# Altium schematic sheet 0109_AUDIO - CODEC MISC.SchDoc
size 848 x 558 mm
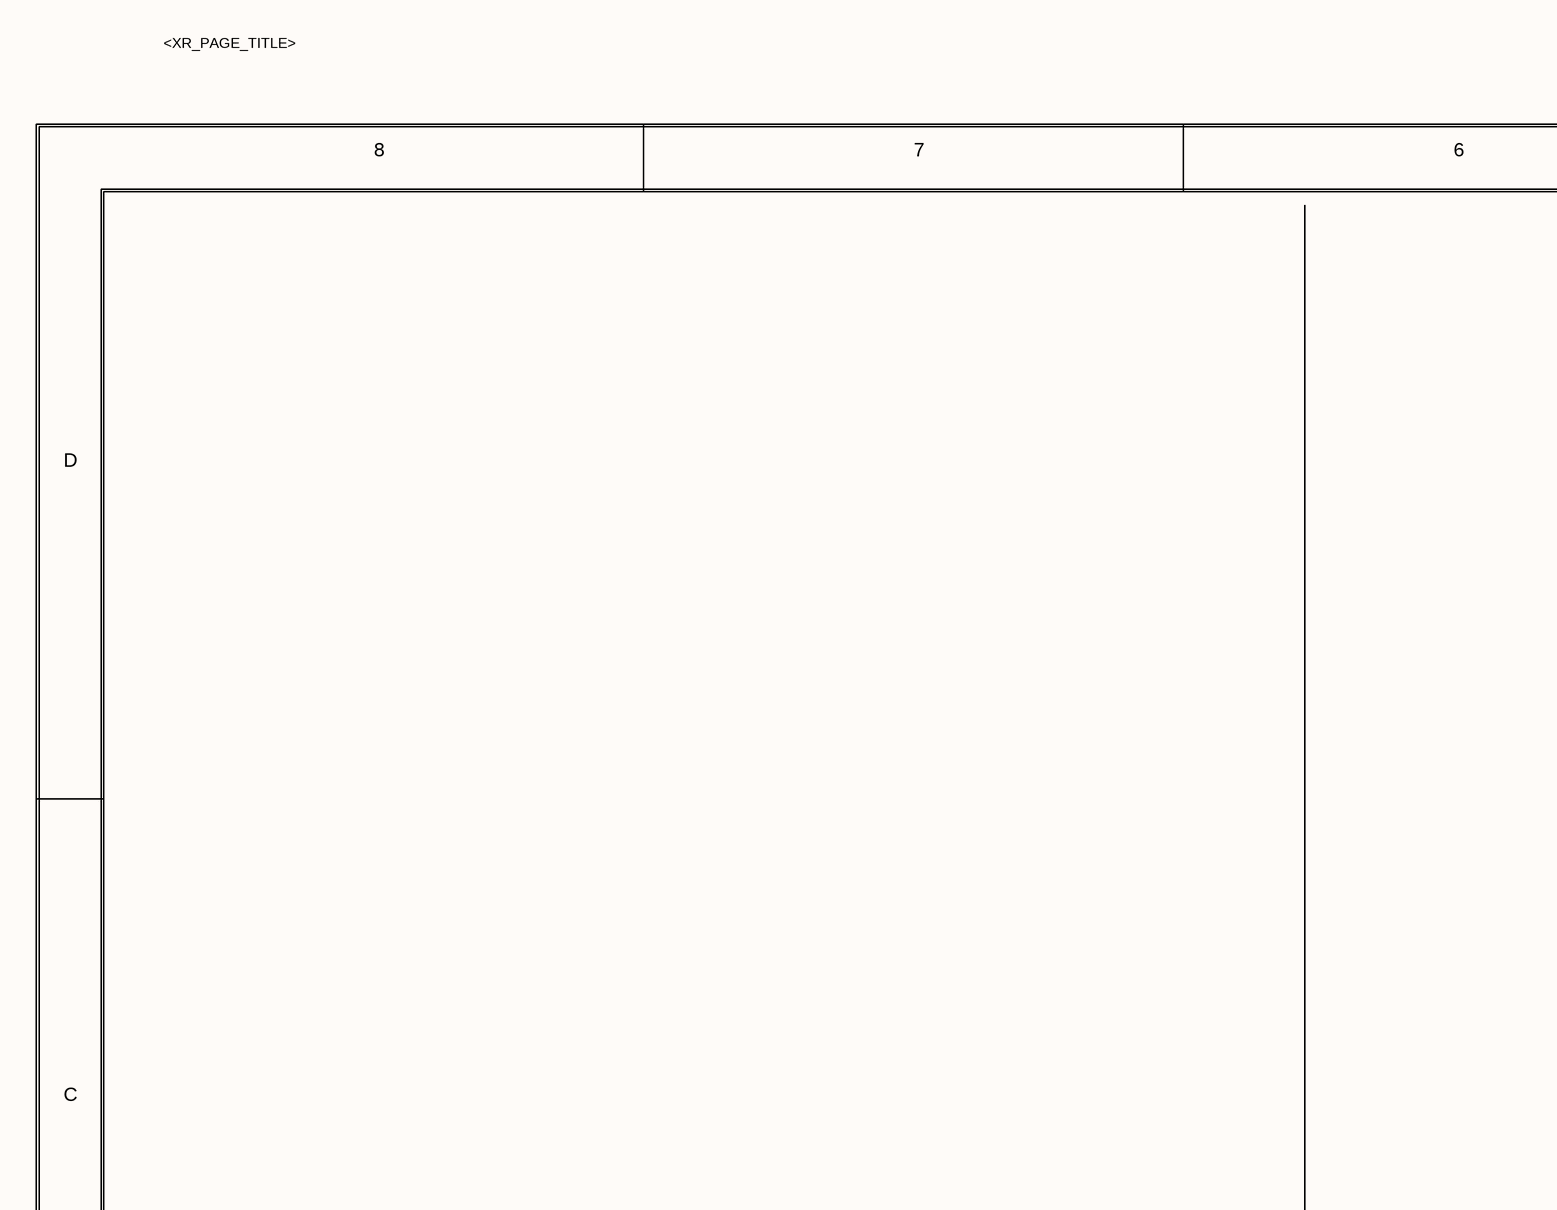
[diagram p0: 0109_AUDIO - CODEC MISC.SchDoc, top left]
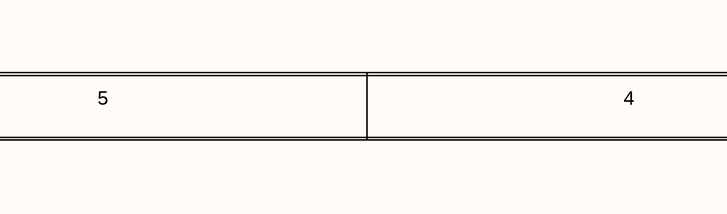
[diagram p1: 0109_AUDIO - CODEC MISC.SchDoc, top middle]
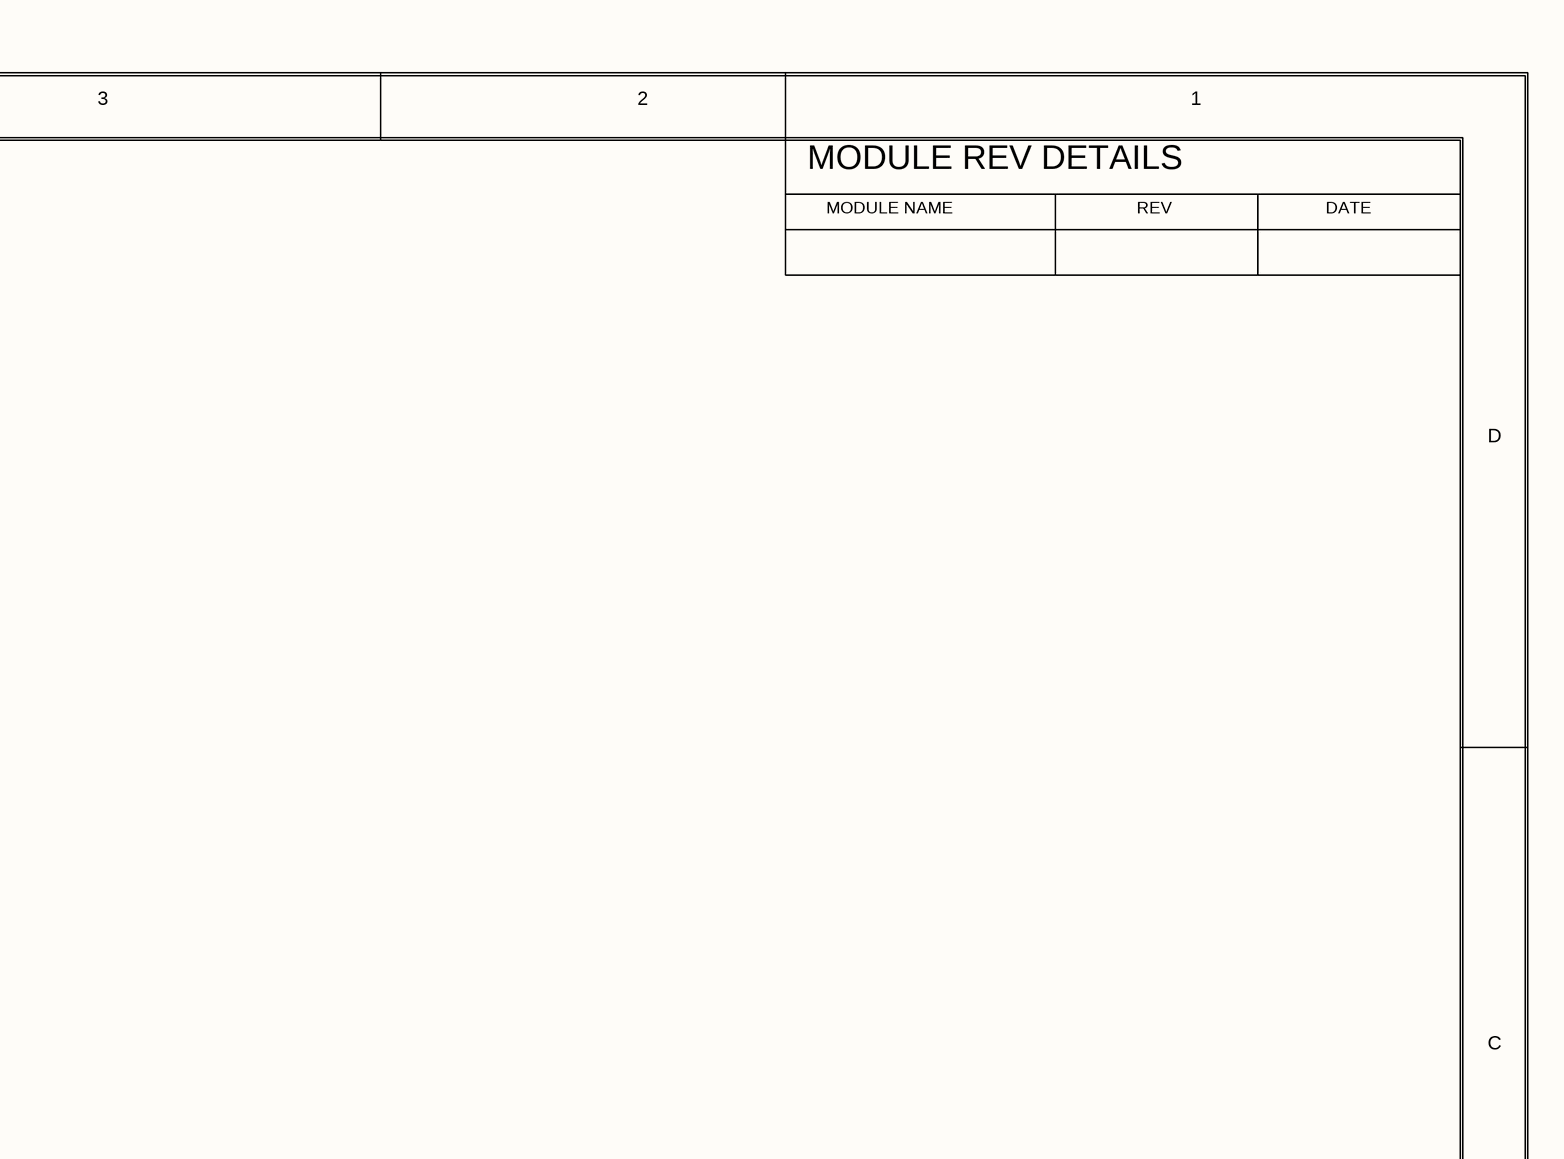
[diagram p2: 0109_AUDIO - CODEC MISC.SchDoc, top right]
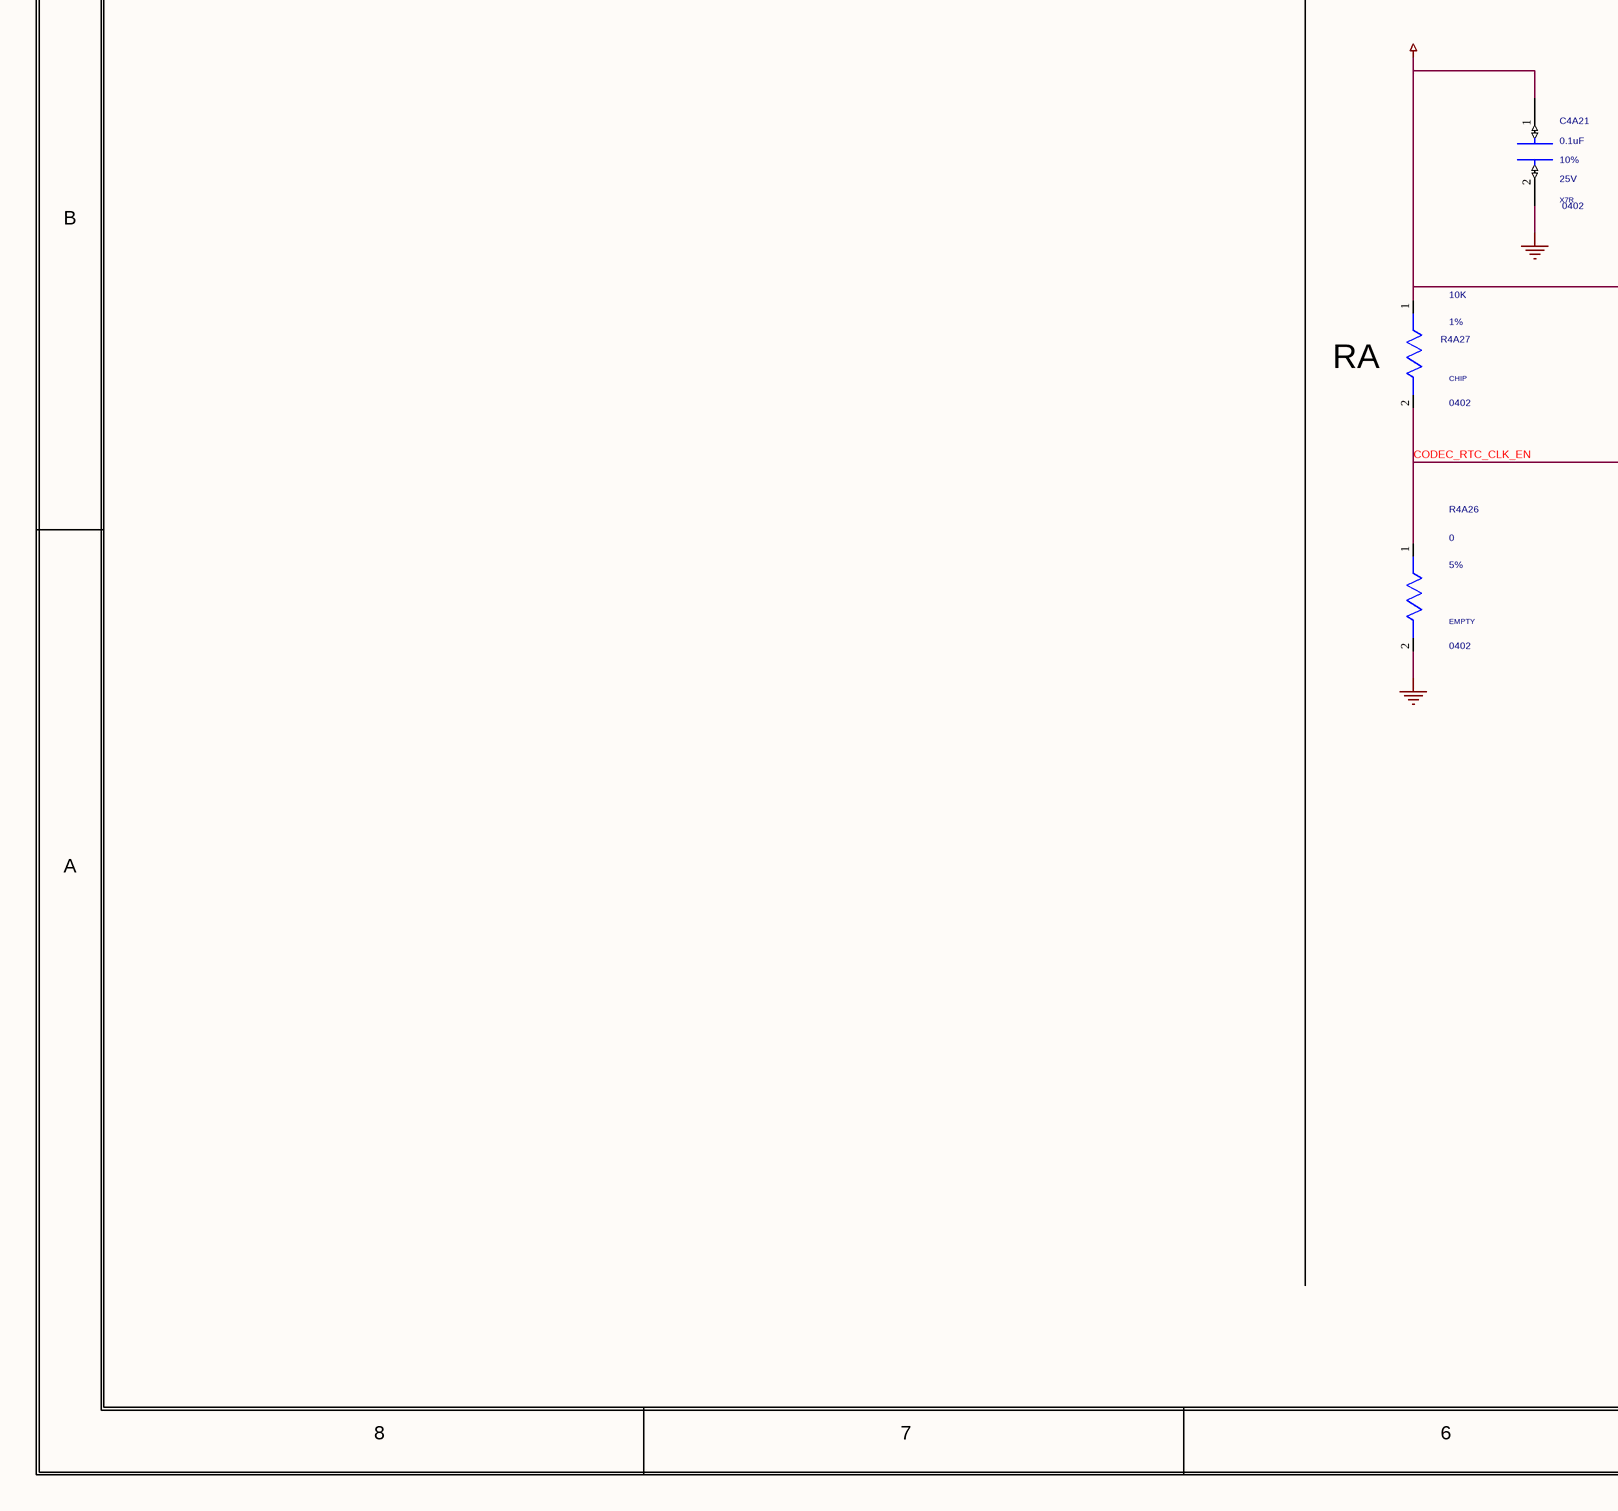
[diagram p3: 0109_AUDIO - CODEC MISC.SchDoc, bottom left]
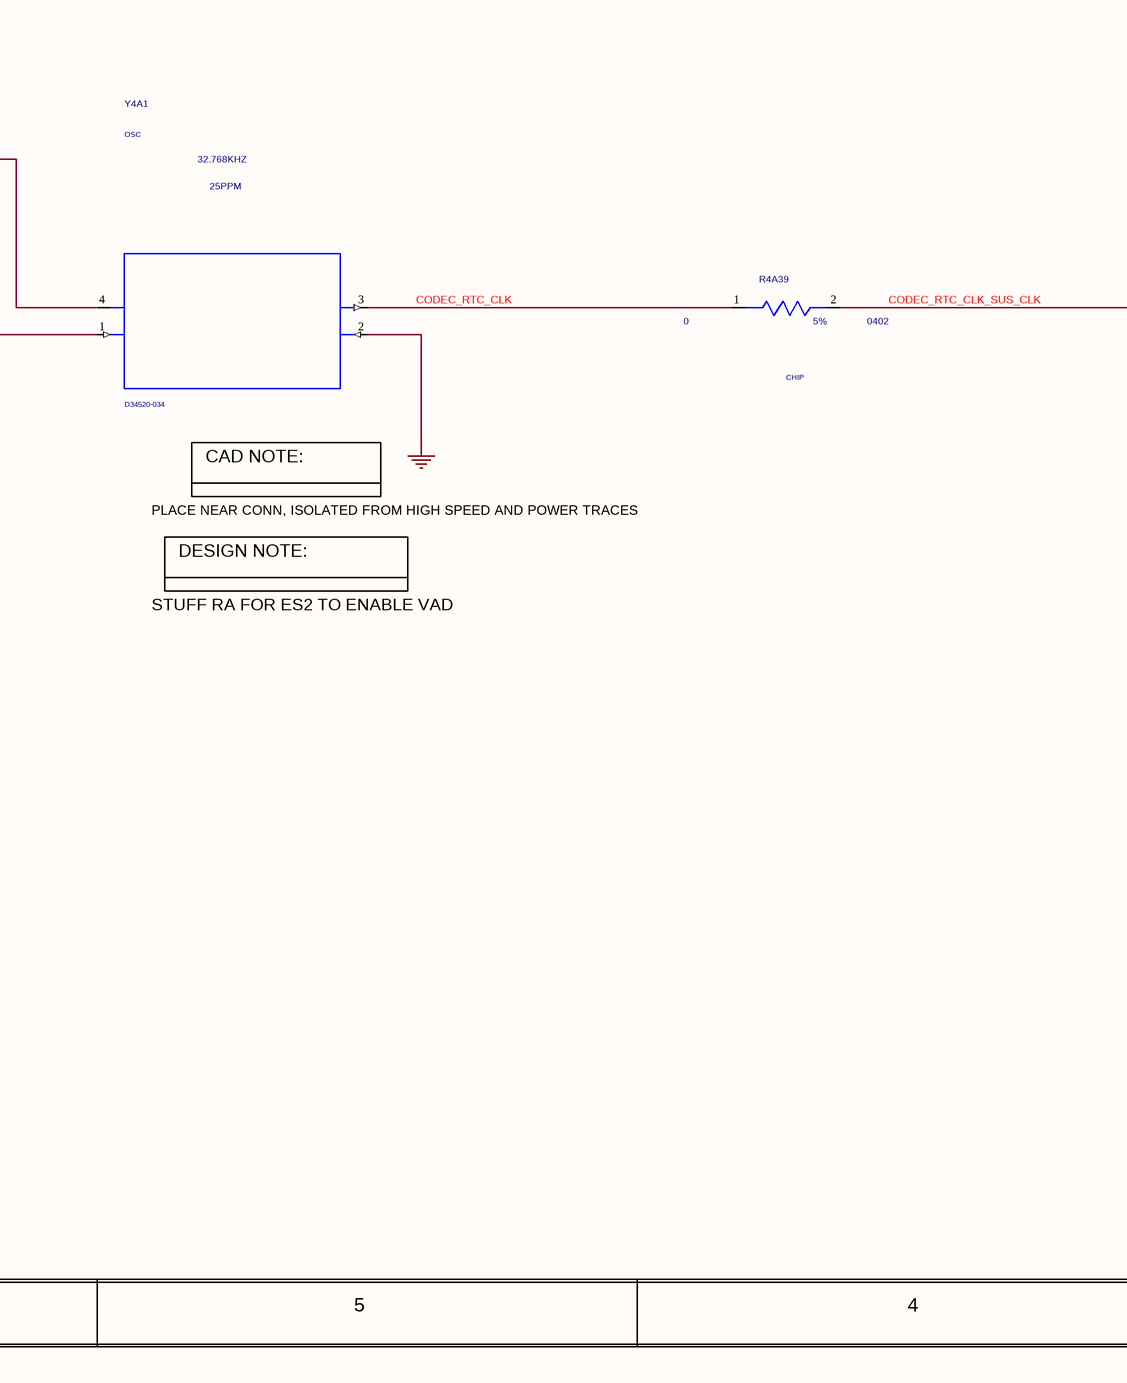
[diagram p4: 0109_AUDIO - CODEC MISC.SchDoc, bottom middle]
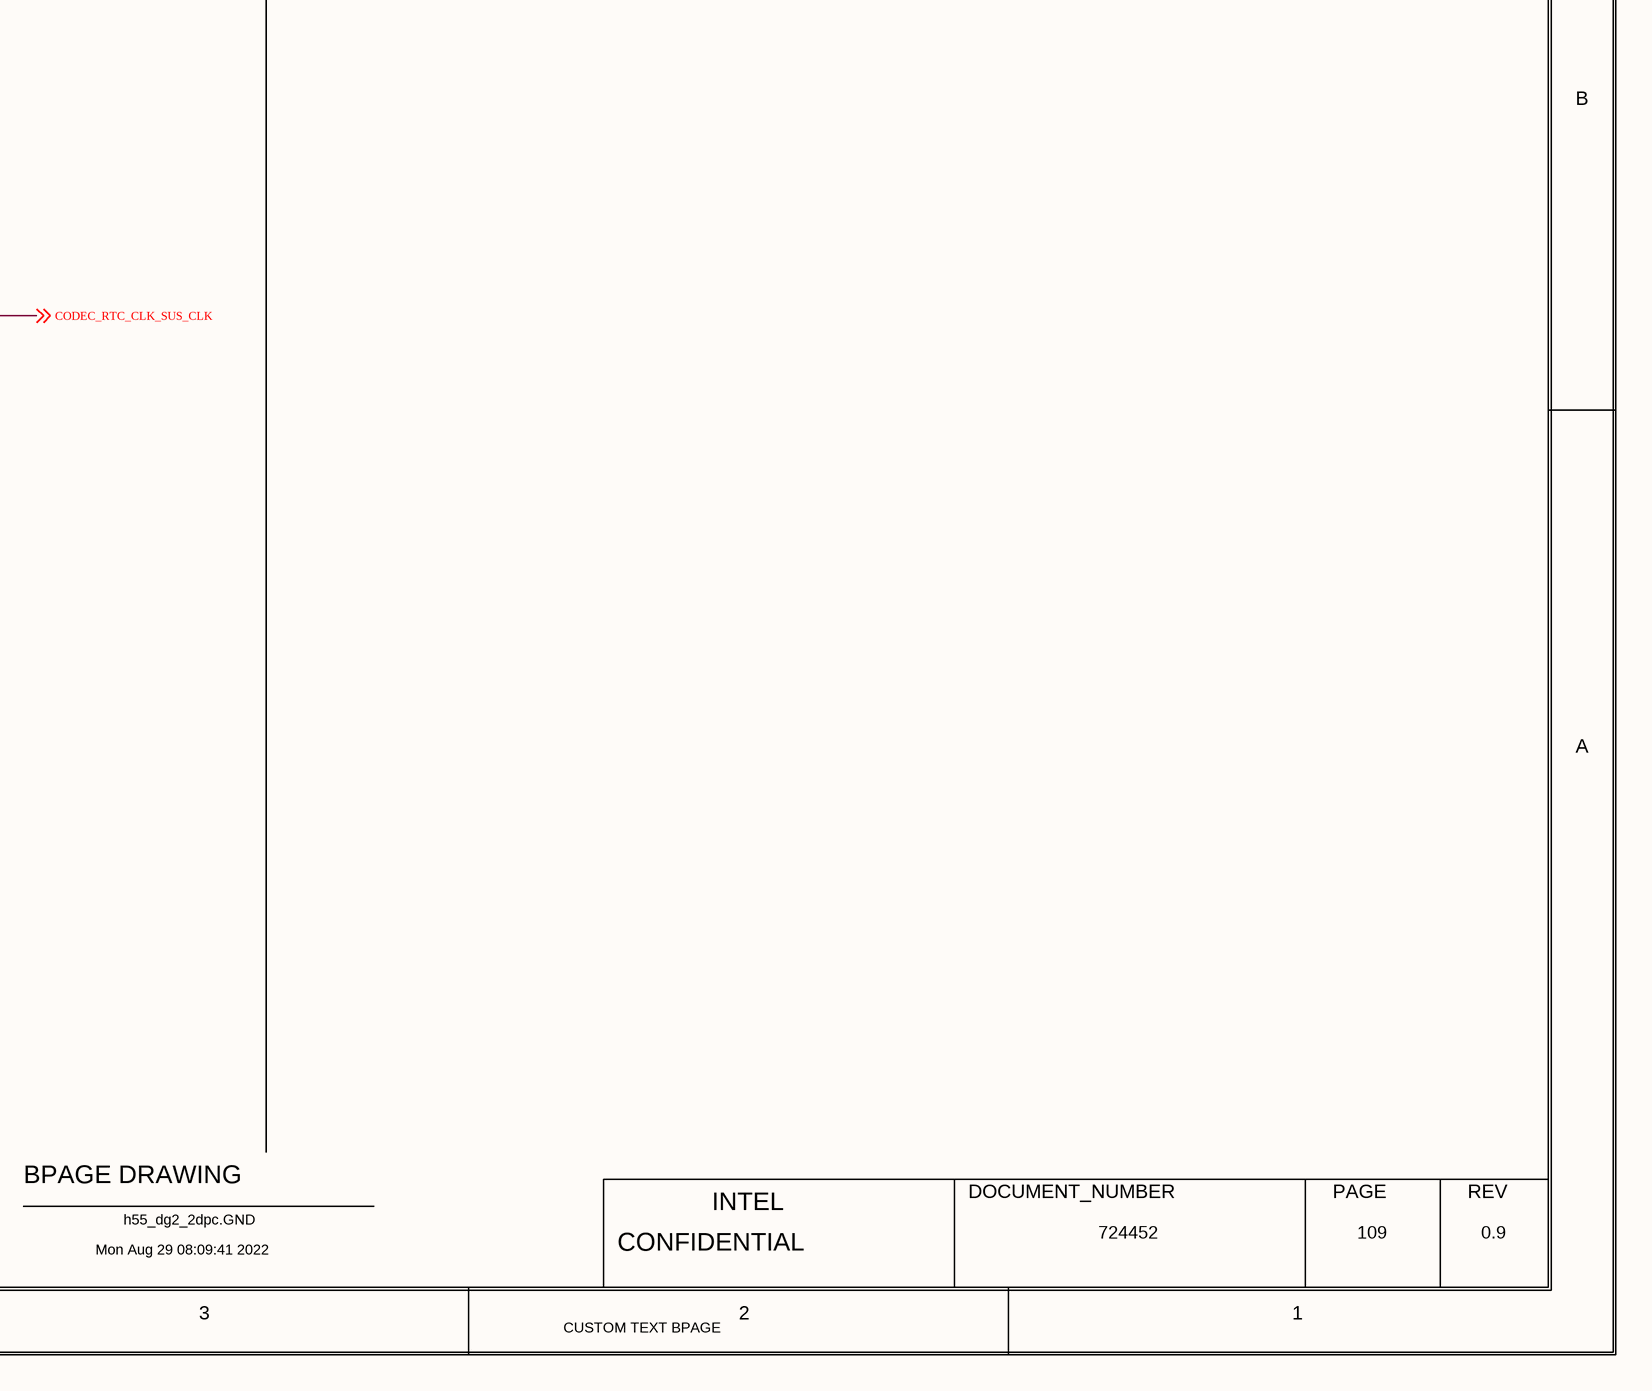
[diagram p5: 0109_AUDIO - CODEC MISC.SchDoc, bottom right]

## Parts
C4A21  0.1uF  MATERIAL: X7R  PACK_TYPE: 0402  TOLERANCE: 10%  VOLTAGE: 25V  [SMC0402IA]
R4A26  0  MATERIAL: EMPTY  PACK_TYPE: 0402  TOLERANCE: 5%  [SMR0402IA]
R4A27  10K  MATERIAL: CHIP  PACK_TYPE: 0402  TOLERANCE: 1%  [SMR0402IA]
R4A39  0  MATERIAL: CHIP  PACK_TYPE: 0402  TOLERANCE: 5%  [SMR0402IA]
Y4A1  32.768KHZ  MATERIAL: OSC  PART_NUMBER: D34520-034  TOLERANCE: 25PPM  [TK0_SOS4_2600X3300_MA]

## Nets
+V1P8A_AUDIO: C4A21.1(A) R4A27.1(A) Y4A1.4(VDD)
GND: C4A21.2(B) R4A26.2(B) Y4A1.2(GND)
CODEC_RTC_CLK: R4A39.1(A) Y4A1.3(OUT)
CODEC_RTC_CLK_EN: R4A26.1(A) R4A27.2(B) Y4A1.1(E_D)
CODEC_RTC_CLK_SUS_CLK: R4A39.2(B) ; off-sheet CODEC_RTC_CLK_SUS_CLK

## Notes on the sheet
- <XR_PAGE_TITLE>
- 8
- 7
- 6
- 5
- 4
- 3
- 2
- 1
- MODULE REV DETAILS
- MODULE NAME
- REV
- DATE
- D
- C
- B
- (near R4A27) RA
- CAD NOTE:
- PLACE NEAR CONN, ISOLATED FROM HIGH SPEED AND POWER TRACES
- DESIGN NOTE:
- STUFF RA FOR ES2 TO ENABLE VAD
- A
- BPAGE DRAWING
- INTEL
- DOCUMENT_NUMBER
- PAGE
- Mon Aug 29 08:09:41 2022
- h55_dg2_2dpc.GND
- CONFIDENTIAL
- 724452
- 109
- 0.9
- CUSTOM TEXT BPAGE

## Library data of the parts
C4A21 = CAP: PART_NUMBER: A36096-112; CDS_PHYS_PART_NAME: CAP_0402-A36096-112,X7R,0.1UF,25V,10%,LPDB,GENERIC; OriginalSymbolOrigin: (-50,25); XY: (3575,2100); VER: 1; ROT: 0; PHYS_PAGE: 109; LOCATION: C4A21; IP: GENERIC; FP_TECH: LPDB; DRAWING: @RVP1_ADL_SB_ADP_S_DDR5_SODIMM_2DPC_LIB.H55_DG2_2DPC(SCH_1):PAGE480; CDS_LIB: discrete; PCB Footprint: SMC0402IA; CHIPS_PART_NAME: CAP; CDS_PART_NAME: CAP_0402-A36096-112,X7R,0.1UF,25V,10%,LPDB,GENERIC; CDS_LOCATION: C4A21; ASI_MODEL: A36096-112
R4A26 = RES: PART_NUMBER: A93549-001; CDS_PHYS_PART_NAME: RES_0402-A93549-001,EMPTY,0,5%,1/16W,LPDB,GENERIC; WATTAGE: 1/16W; OriginalSymbolOrigin: (-25,75); XY: (3350,1275); VER: 2; PHYS_PAGE: 109; LOCATION: R4A26; IP: GENERIC; FP_TECH: LPDB; DRAWING: @RVP1_ADL_SB_ADP_S_DDR5_SODIMM_2DPC_LIB.H55_DG2_2DPC(SCH_1):PAGE480; CDS_LIB: discrete; PCB Footprint: SMR0402IA; ROT: 0; CHIPS_PART_NAME: RES; CDS_PART_NAME: RES_0402-A93549-001,EMPTY,0,5%,1/16W,LPDB,GENERIC; CDS_LOCATION: R4A26; ASI_MODEL: A93549-001
R4A27 = RES: PART_NUMBER: A93548-034; CDS_PHYS_PART_NAME: RES_0402-A93548-034,CHIP,10K,1%,1/16W,LPDB,GENERIC; WATTAGE: 1/16W; OriginalSymbolOrigin: (-25,75); XY: (3350,1725); VER: 2; ROT: 0; PHYS_PAGE: 109; LOCATION: R4A27; IP: GENERIC; FP_TECH: LPDB; DRAWING: @RVP1_ADL_SB_ADP_S_DDR5_SODIMM_2DPC_LIB.H55_DG2_2DPC(SCH_1):PAGE480; CDS_LIB: discrete; PCB Footprint: SMR0402IA; CHIPS_PART_NAME: RES; CDS_PART_NAME: RES_0402-A93548-034,CHIP,10K,1%,1/16W,LPDB,GENERIC; CDS_LOCATION: R4A27; ASI_MODEL: A93548-034
R4A39 = RES#1: PART_NUMBER: A93549-001; CHIPS_PART_NAME: RES; CDS_PHYS_PART_NAME: RES_0402-A93549-001,CHIP,0,5%,1/16W,LPDB,GENERIC; WATTAGE: 1/16W; OriginalSymbolOrigin: (-75,25); XY: (5200,1575); VER: 1; PHYS_PAGE: 109; LOCATION: R4A39; DRAWING: @RVP1_ADL_SB_ADP_S_DDR5_SODIMM_2DPC_LIB.H55_DG2_2DPC(SCH_1):PAGE480; CDS_LIB: discrete; PCB Footprint: SMR0402IA; ROT: 0; CDS_PART_NAME: RES_0402-A93549-001,CHIP,0,5%,1/16W,LPDB,GENERIC; CDS_LOCATION: R4A39; ASI_MODEL: A93549-001
Y4A1 = OSC_4P_D_2: CDS_PHYS_PART_NAME: OSC_4P_D_2_SM-D34520-034,OSC,32.768KHZ,25PPM,TK0,GENERIC,; BOM_USE: NA; CDS_LMAN_SYM_OUTLINE: -200,150,200,-100; FP_TECH: TK0; IP: GENERIC; PACK_TYPE: SM; ROOM: NONE; OriginalSymbolOrigin: (-225,150); XY: (4175,1525); VER: 1; ROT: 0; PHYS_PAGE: 109; LOCATION: Y4A1; DRAWING: @RVP1_ADL_SB_ADP_S_DDR5_SODIMM_2DPC_LIB.H55_DG2_2DPC(SCH_1):PAGE480; CDS_LIB: clock_2; VARIANT: ?; PCB Footprint: TK0_SOS4_2600X3300_MA; SEC_TYPE: SM; CHIPS_PART_NAME: OSC_4P_D_2; CDS_PART_NAME: OSC_4P_D_2_SM-D34520-034,OSC,32.768KHZ,25PPM,TK0,GENERIC,; CDS_LOCATION: Y4A1; ASI_MODEL: D34520-034